# Altium project Helmholtz Driver.PrjPcb
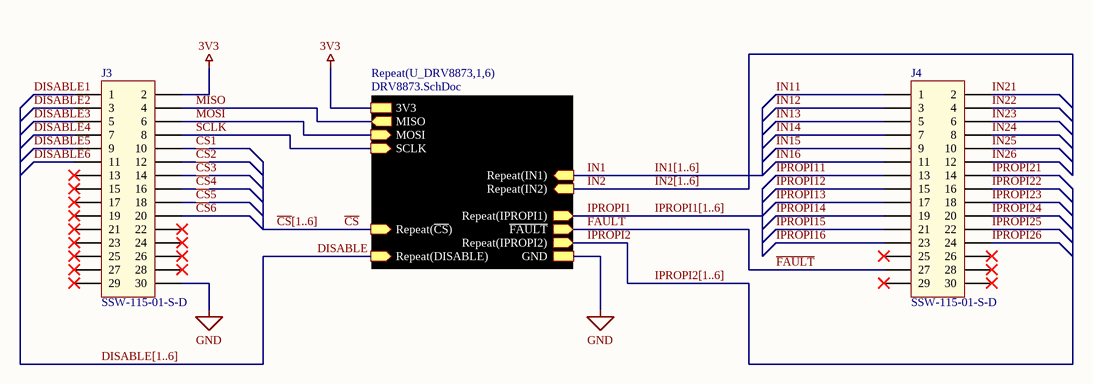
[diagram p0: TOP.SchDoc]
2 sheets, 74 parts. Net scope: hierarchical (ports join the sheet entries above them; power ports are global).
Board file: TOP.PcbDoc
Sheets:
  TOP.SchDoc
    U_DRV88731 = DRV8873.SchDoc
    U_DRV88732 = DRV8873.SchDoc
    U_DRV88733 = DRV8873.SchDoc
    U_DRV88734 = DRV8873.SchDoc
    U_DRV88735 = DRV8873.SchDoc
    U_DRV88736 = DRV8873.SchDoc

## Sheet TOP.SchDoc
size A; SheetNumber: 1; SheetTotal: 2

### Parts
J3  SSW-115-01-S-D  [SSW-115-01-S-D]
J4  SSW-115-01-S-D  [SSW-115-01-S-D]

### Sub-sheets
Repeat(U_DRV8873,1,6) = DRV8873.SchDoc: GND, 3V3, MISO (out), MOSI (in), SCLK (in), Repeat(~{CS}) (in), Repeat(IN1) (in), Repeat(IN2) (in), Repeat(DISABLE) (in), ~{FAULT} (out), Repeat(IPROPI1) (out), Repeat(IPROPI2) (out)

### Nets
3V3: J3.2 ; sheet Repeat(U_DRV8873,1,6)/3V3
GND: J3.30 ; sheet Repeat(U_DRV8873,1,6)/GND
~{CS}: sheet Repeat(U_DRV8873,1,6)/Repeat(~{CS})
~{CS}1: J3.10  [project net ~{CS}]
~{CS}2: J3.12  [project net ~{CS}]
~{CS}3: J3.14  [project net ~{CS}]
~{CS}4: J3.16  [project net ~{CS}]
~{CS}5: J3.18  [project net ~{CS}]
~{CS}6: J3.20  [project net ~{CS}]
DISABLE: sheet Repeat(U_DRV8873,1,6)/Repeat(DISABLE)
DISABLE1: J3.1  [project net DISABLE]
DISABLE2: J3.3  [project net DISABLE]
DISABLE3: J3.5  [project net DISABLE]
DISABLE4: J3.7  [project net DISABLE]
DISABLE5: J3.9  [project net DISABLE]
DISABLE6: J3.11  [project net DISABLE]
~{FAULT}: J4.27 ; sheet Repeat(U_DRV8873,1,6)/~{FAULT}
IN1: sheet Repeat(U_DRV8873,1,6)/Repeat(IN1)
IN2: sheet Repeat(U_DRV8873,1,6)/Repeat(IN2)
IN11: J4.1  [project net IN1]
IN12: J4.3  [project net IN1]
IN13: J4.5  [project net IN1]
IN14: J4.7  [project net IN1]
IN15: J4.9  [project net IN1]
IN16: J4.11  [project net IN1]
IN21: J4.2  [project net IN2]
IN22: J4.4  [project net IN2]
IN23: J4.6  [project net IN2]
IN24: J4.8  [project net IN2]
IN25: J4.10  [project net IN2]
IN26: J4.12  [project net IN2]
IPROPI1: sheet Repeat(U_DRV8873,1,6)/Repeat(IPROPI1)
IPROPI2: sheet Repeat(U_DRV8873,1,6)/Repeat(IPROPI2)
IPROPI11: J4.13  [project net IPROPI1]
IPROPI12: J4.15  [project net IPROPI1]
IPROPI13: J4.17  [project net IPROPI1]
IPROPI14: J4.19  [project net IPROPI1]
IPROPI15: J4.21  [project net IPROPI1]
IPROPI16: J4.23  [project net IPROPI1]
IPROPI21: J4.14  [project net IPROPI2]
IPROPI22: J4.16  [project net IPROPI2]
IPROPI23: J4.18  [project net IPROPI2]
IPROPI24: J4.20  [project net IPROPI2]
IPROPI25: J4.22  [project net IPROPI2]
IPROPI26: J4.24  [project net IPROPI2]
MISO: J3.4 ; sheet Repeat(U_DRV8873,1,6)/MISO
MOSI: J3.6 ; sheet Repeat(U_DRV8873,1,6)/MOSI
SCLK: J3.8 ; sheet Repeat(U_DRV8873,1,6)/SCLK

Not connected (* = marked no-connect by the designer): J3 13* 15* 17* 19* 21* 22* 23* 24* 25* 26* 27* 28* 29*; J4 25* 26* 28* 29* 30*

### Buses and harness runs
bus DISABLE[1..6]
bus IN1[1..6]
bus IN2[1..6]
bus IPROPI1[1..6]
bus IPROPI2[1..6]
bus ~{CS}[1..6]

### Library data of the parts
J3 J4 = CMPL-001-B539-A.1: CONN RCPT 30POS 0.1 GOLD PCB; Manufacturer: Samtec Inc.; Pitch: 0.100" (2.54mm); Number of Positions: 30; Number of Positions Loaded: All; Connector Type: Receptacle; Color: Black; Mounting Type: Through Hole; RoHS Compliance: Yes; Manufacturer Part Number: SSW-115-01-S-D; Supplier 1 Part Number: SAM1210-15-ND; Contact Finish Thickness: 30.0µin (0.76µm); Number of Rows: 2; Termination: Solder; Supplier 1: Digikey; Contact Finish: Gold; Row Spacing: -; Contact Type: Forked

## Sheet DRV8873.SchDoc
size A; SheetNumber: 2; SheetTotal: 2
Used 6 times, as channels U_DRV88731, U_DRV88732, U_DRV88733, U_DRV88734, U_DRV88735, U_DRV88736. Parts and nets are listed once, with the designators drawn on the sheet.
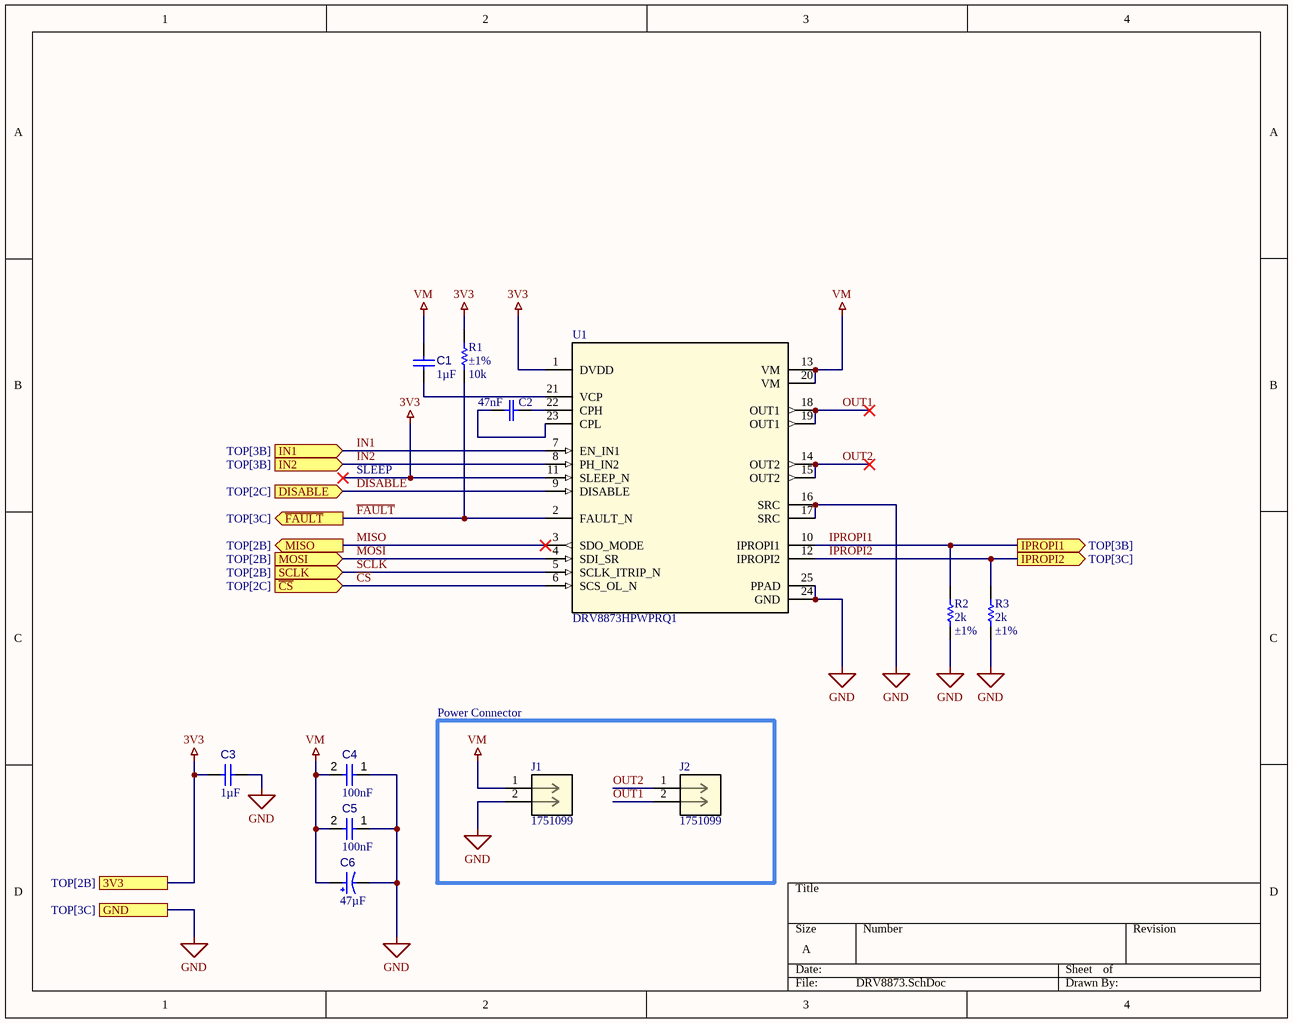
[diagram p1: DRV8873.SchDoc]

### Parts
C1  value 1µF  [CAPC1608X94X35NL15T15]  (hidden comment: Capacitor 1 uF +/- 10% 16 V 0603)
C2  47nF  [CAPC220145_90N_KEM]
C3  value 1µF  [CAPC1608X94X35NL15T15]  (hidden comment: Capacitor 1 uF +/- 10% 16 V 0603)
C4  value 100nF  [CAPC1608X90X40NL10T20]  (hidden comment: Capacitor 100 nF +/-10% 50 V 0603)
C5  value 100nF  [CAPC1608X90X40NL10T20]  (hidden comment: Capacitor 100 nF +/-10% 50 V 0603)
C6  value 47µF  [CAPPR55-250-1120X630X1220]  (hidden comment: ECA-1HM470)
J1  1751099  [CONN_1751099_PXC]
J2  1751099  [CONN_1751099_PXC]
R1  Tolerance: ±1%  Resistance: 10k  [RESC0603L]
R2  Resistance: 2k  Tolerance: ±1%  [RESC0805L]  (hidden comment: ERJ-P06F2001V)
R3  Resistance: 2k  Tolerance: ±1%  [RESC0805L]  (hidden comment: ERJ-P06F2001V)
U1  DRV8873HPWPRQ1  [PWP0024J_N]

### Blocks framed on the sheet
Power Connector: J1 J2

### Ports
3V3 (see TOP[2B]), DISABLE (in, see TOP[2C]), GND (see TOP[3C]), IN1 (in, see TOP[3B]), IN2 (in, see TOP[3B]), IPROPI1 (out, see TOP[3B]), IPROPI2 (out, see TOP[3C]), MISO (out, see TOP[2B]), MOSI (in, see TOP[2B]), SCLK (in, see TOP[2B]), ~{CS} (in, see TOP[2C]), ~{FAULT} (out, see TOP[3C])

### Nets
3V3: C3.2 R1.2 U1.1(DVDD) U1.11(SLEEP_N) ; port 3V3
GND: C3.1 C4.1 C5.1 C6.2 J1.2 R2.1 R3.1 U1.16(SRC) U1.17(SRC) U1.24(GND) U1.25(PPAD) ; port GND
VM: C1.2 C4.2 C5.2 C6.1 J1.1 U1.13(VM) U1.20(VM)
~{CS}: U1.6(SCS_OL_N) ; port ~{CS}
DISABLE: U1.9(DISABLE) ; port DISABLE
~{FAULT}: R1.1 U1.2(FAULT_N) ; port ~{FAULT}
IN1: U1.7(EN_IN1) ; port IN1
IN2: U1.8(PH_IN2) ; port IN2
IPROPI1: R2.2 U1.10(IPROPI1) ; port IPROPI1
IPROPI2: R3.2 U1.12(IPROPI2) ; port IPROPI2
MISO: U1.3(SDO_MODE) ; port MISO
MOSI: U1.4(SDI_SR) ; port MOSI
OUT1: J2.2 U1.18(OUT1) U1.19(OUT1)
OUT2: J2.1 U1.14(OUT2) U1.15(OUT2)
SCLK: U1.5(SCLK_ITRIP_N) ; port SCLK
NetC1_1: C1.1 U1.21(VCP)
NetC2_1: C2.1 U1.23(CPL)
NetC2_2: C2.2 U1.22(CPH)

### Channels
U_DRV88731: designators end in _U_DRV88731; ports 3V3=3V3 DISABLE=DISABLE GND=GND IN1=IN1 IN2=IN2 IPROPI1=IPROPI1 IPROPI2=IPROPI2 MISO=MISO MOSI=MOSI SCLK=SCLK ~{CS}=~{CS} ~{FAULT}=~{FAULT}
U_DRV88732: designators end in _U_DRV88732; ports 3V3=3V3 DISABLE=DISABLE GND=GND IN1=IN1 IN2=IN2 IPROPI1=IPROPI1 IPROPI2=IPROPI2 MISO=MISO MOSI=MOSI SCLK=SCLK ~{CS}=~{CS} ~{FAULT}=~{FAULT}
U_DRV88733: designators end in _U_DRV88733; ports 3V3=3V3 DISABLE=DISABLE GND=GND IN1=IN1 IN2=IN2 IPROPI1=IPROPI1 IPROPI2=IPROPI2 MISO=MISO MOSI=MOSI SCLK=SCLK ~{CS}=~{CS} ~{FAULT}=~{FAULT}
U_DRV88734: designators end in _U_DRV88734; ports 3V3=3V3 DISABLE=DISABLE GND=GND IN1=IN1 IN2=IN2 IPROPI1=IPROPI1 IPROPI2=IPROPI2 MISO=MISO MOSI=MOSI SCLK=SCLK ~{CS}=~{CS} ~{FAULT}=~{FAULT}
U_DRV88735: designators end in _U_DRV88735; ports 3V3=3V3 DISABLE=DISABLE GND=GND IN1=IN1 IN2=IN2 IPROPI1=IPROPI1 IPROPI2=IPROPI2 MISO=MISO MOSI=MOSI SCLK=SCLK ~{CS}=~{CS} ~{FAULT}=~{FAULT}
U_DRV88736: designators end in _U_DRV88736; ports 3V3=3V3 DISABLE=DISABLE GND=GND IN1=IN1 IN2=IN2 IPROPI1=IPROPI1 IPROPI2=IPROPI2 MISO=MISO MOSI=MOSI SCLK=SCLK ~{CS}=~{CS} ~{FAULT}=~{FAULT}

### Notes on the sheet
- SLEEP

### Library data of the parts
C1 C3 = CMP-001-00003-7: Chip Capacitor, 1 uF, +/- 10%, 16 V, 0603 (1608 Metric); Voltage Rating: 16V; Capacitor Type: Ceramic; Tolerance: 10%; Case/Package: 0603; RoHS Compliant: True; Min Operating Temperature: -55°C; Mounting Technology: SM; Pins: 2; Max Operating Temperature: 125°C
C2 = CMP-001-00085-2: No Description Available; Mfr_Name: Kemet; Source: C0805C473K5RACTU.SchLib; Design Item ID: C0805C473K5RACTU
C4 C5 = CMP-001-00017-7: Chip Capacitor, 100 nF, +/- 10%, 50 V, 0603 (1608 Metric); Capacitor Type: Ceramic; Voltage Rating: 50V; Mounting Technology: SM; Tolerance: 10%; Pins: 2; Max Operating Temperature: 125°C; Case/Package: 0603; RoHS Compliant: True; Min Operating Temperature: -55°C
C6 = CMP-001-00031-7: Aluminum Electrolytic Capacitor, 47 uF, +/-20%, 50 V, -40 to 85 degC, 2-Pin THD, RoHS, Bulk; Manufacturer: Panasonic; Ripple Current: 130mA; Voltage Rating: 50V; Tolerance: 20%; RoHS Compliant: True; Lead Pitch: 2.5mm; Packaging: Bulk; Case/Package: Radial; Diameter: 6.3mm; Datasheet Version: Apr-16; Mounting Technology: TH; Max Operating Temperature: 85°C; Package Quantity: 200; Package Description: 2-Pin Radial Lead, Dia 6.3 mm, Height 12.2 mm; Capacitor Type: Electrolytic; Min Operating Temperature: -40°C; Ripple Current (AC): 130mA; Manufacturer URL: http://www.panasonic.com/; Pins: 2; Datasheet URL: https://industrial.panasonic.com/cdbs/www-data/pdf/RDF0000/DMF0000COL72.pdf; Package Reference: CAPPR55-250-1120X630X1220
J1 J2 = CMP-002-000007-1: No Description Available; Mfr_Name: Phoenix Contact; Type: Type; Source: 1751099.SchLib; Design Item ID: 1751099; RefDes: RefDes; Digi-Key_Part_Number_1: 277-5924-ND
R1 = CMPL-001-A004-A.5: RES SMD 10K OHM 1% 1/10W 0603; Manufacturer: Vishay Dale; Manufacturer Part Number: CRCW060310K0FKEA; FUTEK Item #: GOD04653; Power (Watts): 0.1W, 1/10W; Temperature Coefficient: ±100ppm/°C; RoHS Compliance: Yes; Supplier 1 Part Number: 541-10.0KHCT-ND; Operating Temperature: -55°C ~ 155°C; Package: 0603; Supplier 1: Digikey; Composition: Thick Film; Features: Automotive AEC-Q200
R2 R3 = CMPL-001-A887-A.2: RES SMD 2K OHM 1% 1/2W 0805; Manufacturer: Panasonic Electronic Components; Temperature Coefficient: ±100ppm/°C; Power (Watts): 0.5W, 1/2W; Package: 0805; Features: Automotive AEC-Q200, Pulse Withstanding; Supplier 1: Digikey; Composition: Thick Film; RoHS Compliant: Yes; Supplier 1 Part Number: P16065CT-ND; Operating Temperature: -55°C ~ 155°C; Manufacturer Part Number: ERJ-P06F2001V
U1 = CMP-002-000006-1: No Description Available; Mfr_Name: Texas Instruments; TYPE: TYPE; Design Item ID: DRV8873HPWPRQ1; RefDes: RefDes; Source: DRV8873HPWPRQ1.SchLib

## Nets that join several sheets
3V3: TOP (J3.2), U_DRV88731 (C3_U_DRV88731.2 R1_U_DRV88731.2 U1_U_DRV88731.1 U1_U_DRV88731.11), U_DRV88732 (C3_U_DRV88732.2 R1_U_DRV88732.2 U1_U_DRV88732.1 U1_U_DRV88732.11), U_DRV88733 (C3_U_DRV88733.2 R1_U_DRV88733.2 U1_U_DRV88733.1 U1_U_DRV88733.11), U_DRV88734 (C3_U_DRV88734.2 R1_U_DRV88734.2 U1_U_DRV88734.1 U1_U_DRV88734.11), U_DRV88735 (C3_U_DRV88735.2 R1_U_DRV88735.2 U1_U_DRV88735.1 U1_U_DRV88735.11), U_DRV88736 (C3_U_DRV88736.2 R1_U_DRV88736.2 U1_U_DRV88736.1 U1_U_DRV88736.11)
GND: TOP (J3.30), U_DRV88731 (11 pins), U_DRV88732 (11 pins), U_DRV88733 (11 pins), U_DRV88734 (11 pins), U_DRV88735 (11 pins), U_DRV88736 (11 pins)
VM: U_DRV88731 (7 pins), U_DRV88732 (7 pins), U_DRV88733 (7 pins), U_DRV88734 (7 pins), U_DRV88735 (7 pins), U_DRV88736 (7 pins)
~{CS}: TOP (J3.10), U_DRV88731 (U1_U_DRV88731.6)
~{CS}: TOP (J3.12), U_DRV88732 (U1_U_DRV88732.6)
~{CS}: TOP (J3.14), U_DRV88733 (U1_U_DRV88733.6)
~{CS}: TOP (J3.16), U_DRV88734 (U1_U_DRV88734.6)
~{CS}: TOP (J3.18), U_DRV88735 (U1_U_DRV88735.6)
~{CS}: TOP (J3.20), U_DRV88736 (U1_U_DRV88736.6)
DISABLE: TOP (J3.1), U_DRV88731 (U1_U_DRV88731.9)
DISABLE: TOP (J3.3), U_DRV88732 (U1_U_DRV88732.9)
DISABLE: TOP (J3.5), U_DRV88733 (U1_U_DRV88733.9)
DISABLE: TOP (J3.7), U_DRV88734 (U1_U_DRV88734.9)
DISABLE: TOP (J3.9), U_DRV88735 (U1_U_DRV88735.9)
DISABLE: TOP (J3.11), U_DRV88736 (U1_U_DRV88736.9)
~{FAULT}: TOP (J4.27), U_DRV88731 (R1_U_DRV88731.1 U1_U_DRV88731.2), U_DRV88732 (R1_U_DRV88732.1 U1_U_DRV88732.2), U_DRV88733 (R1_U_DRV88733.1 U1_U_DRV88733.2), U_DRV88734 (R1_U_DRV88734.1 U1_U_DRV88734.2), U_DRV88735 (R1_U_DRV88735.1 U1_U_DRV88735.2), U_DRV88736 (R1_U_DRV88736.1 U1_U_DRV88736.2)
IN1: TOP (J4.1), U_DRV88731 (U1_U_DRV88731.7)
IN1: TOP (J4.3), U_DRV88732 (U1_U_DRV88732.7)
IN1: TOP (J4.5), U_DRV88733 (U1_U_DRV88733.7)
IN1: TOP (J4.7), U_DRV88734 (U1_U_DRV88734.7)
IN1: TOP (J4.9), U_DRV88735 (U1_U_DRV88735.7)
IN1: TOP (J4.11), U_DRV88736 (U1_U_DRV88736.7)
IN2: TOP (J4.2), U_DRV88731 (U1_U_DRV88731.8)
IN2: TOP (J4.4), U_DRV88732 (U1_U_DRV88732.8)
IN2: TOP (J4.6), U_DRV88733 (U1_U_DRV88733.8)
IN2: TOP (J4.8), U_DRV88734 (U1_U_DRV88734.8)
IN2: TOP (J4.10), U_DRV88735 (U1_U_DRV88735.8)
IN2: TOP (J4.12), U_DRV88736 (U1_U_DRV88736.8)
IPROPI1: TOP (J4.13), U_DRV88731 (R2_U_DRV88731.2 U1_U_DRV88731.10)
IPROPI1: TOP (J4.15), U_DRV88732 (R2_U_DRV88732.2 U1_U_DRV88732.10)
IPROPI1: TOP (J4.17), U_DRV88733 (R2_U_DRV88733.2 U1_U_DRV88733.10)
IPROPI1: TOP (J4.19), U_DRV88734 (R2_U_DRV88734.2 U1_U_DRV88734.10)
IPROPI1: TOP (J4.21), U_DRV88735 (R2_U_DRV88735.2 U1_U_DRV88735.10)
IPROPI1: TOP (J4.23), U_DRV88736 (R2_U_DRV88736.2 U1_U_DRV88736.10)
IPROPI2: TOP (J4.14), U_DRV88731 (R3_U_DRV88731.2 U1_U_DRV88731.12)
IPROPI2: TOP (J4.16), U_DRV88732 (R3_U_DRV88732.2 U1_U_DRV88732.12)
IPROPI2: TOP (J4.18), U_DRV88733 (R3_U_DRV88733.2 U1_U_DRV88733.12)
IPROPI2: TOP (J4.20), U_DRV88734 (R3_U_DRV88734.2 U1_U_DRV88734.12)
IPROPI2: TOP (J4.22), U_DRV88735 (R3_U_DRV88735.2 U1_U_DRV88735.12)
IPROPI2: TOP (J4.24), U_DRV88736 (R3_U_DRV88736.2 U1_U_DRV88736.12)
MISO: TOP (J3.4), U_DRV88731 (U1_U_DRV88731.3), U_DRV88732 (U1_U_DRV88732.3), U_DRV88733 (U1_U_DRV88733.3), U_DRV88734 (U1_U_DRV88734.3), U_DRV88735 (U1_U_DRV88735.3), U_DRV88736 (U1_U_DRV88736.3)
MOSI: TOP (J3.6), U_DRV88731 (U1_U_DRV88731.4), U_DRV88732 (U1_U_DRV88732.4), U_DRV88733 (U1_U_DRV88733.4), U_DRV88734 (U1_U_DRV88734.4), U_DRV88735 (U1_U_DRV88735.4), U_DRV88736 (U1_U_DRV88736.4)
SCLK: TOP (J3.8), U_DRV88731 (U1_U_DRV88731.5), U_DRV88732 (U1_U_DRV88732.5), U_DRV88733 (U1_U_DRV88733.5), U_DRV88734 (U1_U_DRV88734.5), U_DRV88735 (U1_U_DRV88735.5), U_DRV88736 (U1_U_DRV88736.5)